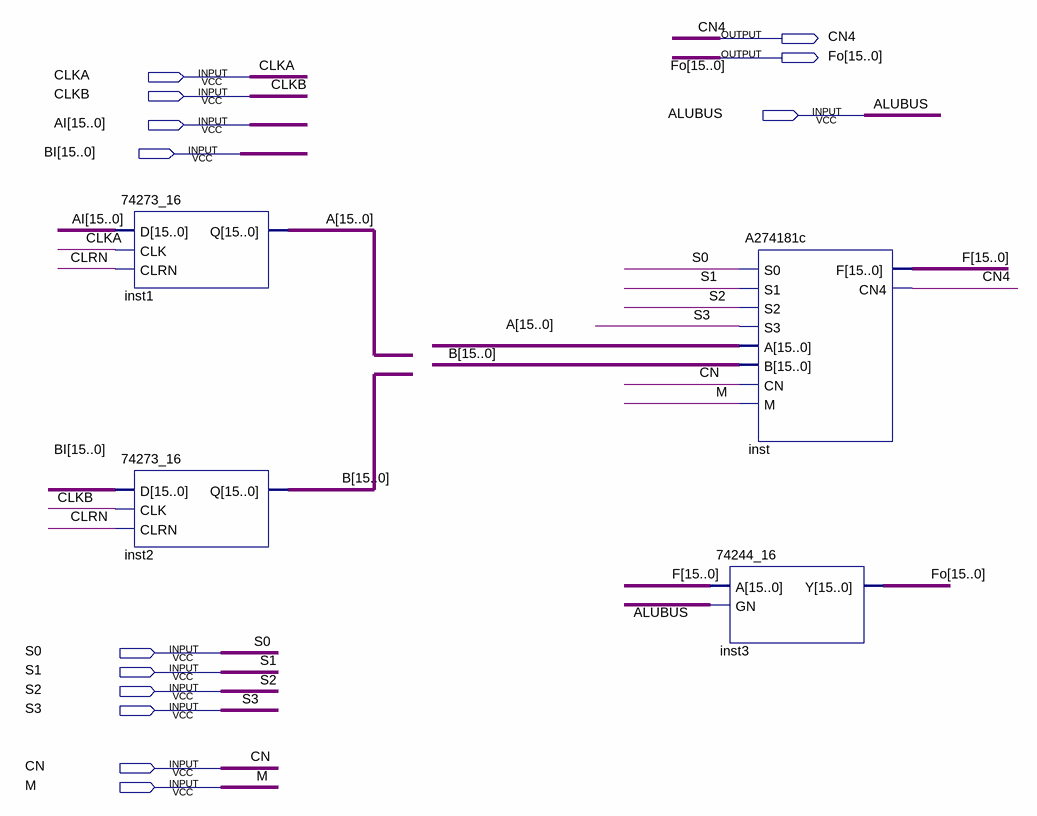
[diagram p0: schematic sheet]
// Quartus schematic A2ADD16c.bdf as structural Verilog: 4 symbols, 13 pins
module A2ADD16c (
  input  CLKA,
  input  CLKB,
  input  ALUBUS,
  input  [15:0] AI,
  input  [15:0] BI,
  input  S0,
  input  S1,
  input  S2,
  input  S3,
  input  CN,
  input  M,
  output CN4,
  output [15:0] Fo
);

  wire CLRN;
  wire [15:0] A, B, F;

  \74273_16  inst1 (.D(AI), .CLK(CLKA), .CLRN(CLRN), .Q(A));
  \74273_16  inst2 (.D(BI), .CLK(CLKB), .CLRN(CLRN), .Q(B));
  \74244_16  inst3 (.A(F), .GN(ALUBUS), .Y(Fo));
  A274181c inst (.S0(S0), .S1(S1), .S2(S2), .S3(S3), .A(A), .B(B), .CN(CN), .M(M), .F(F), .CN4(CN4));
endmodule
